# EAGLE design version1 (EAGLE 8.3.2)
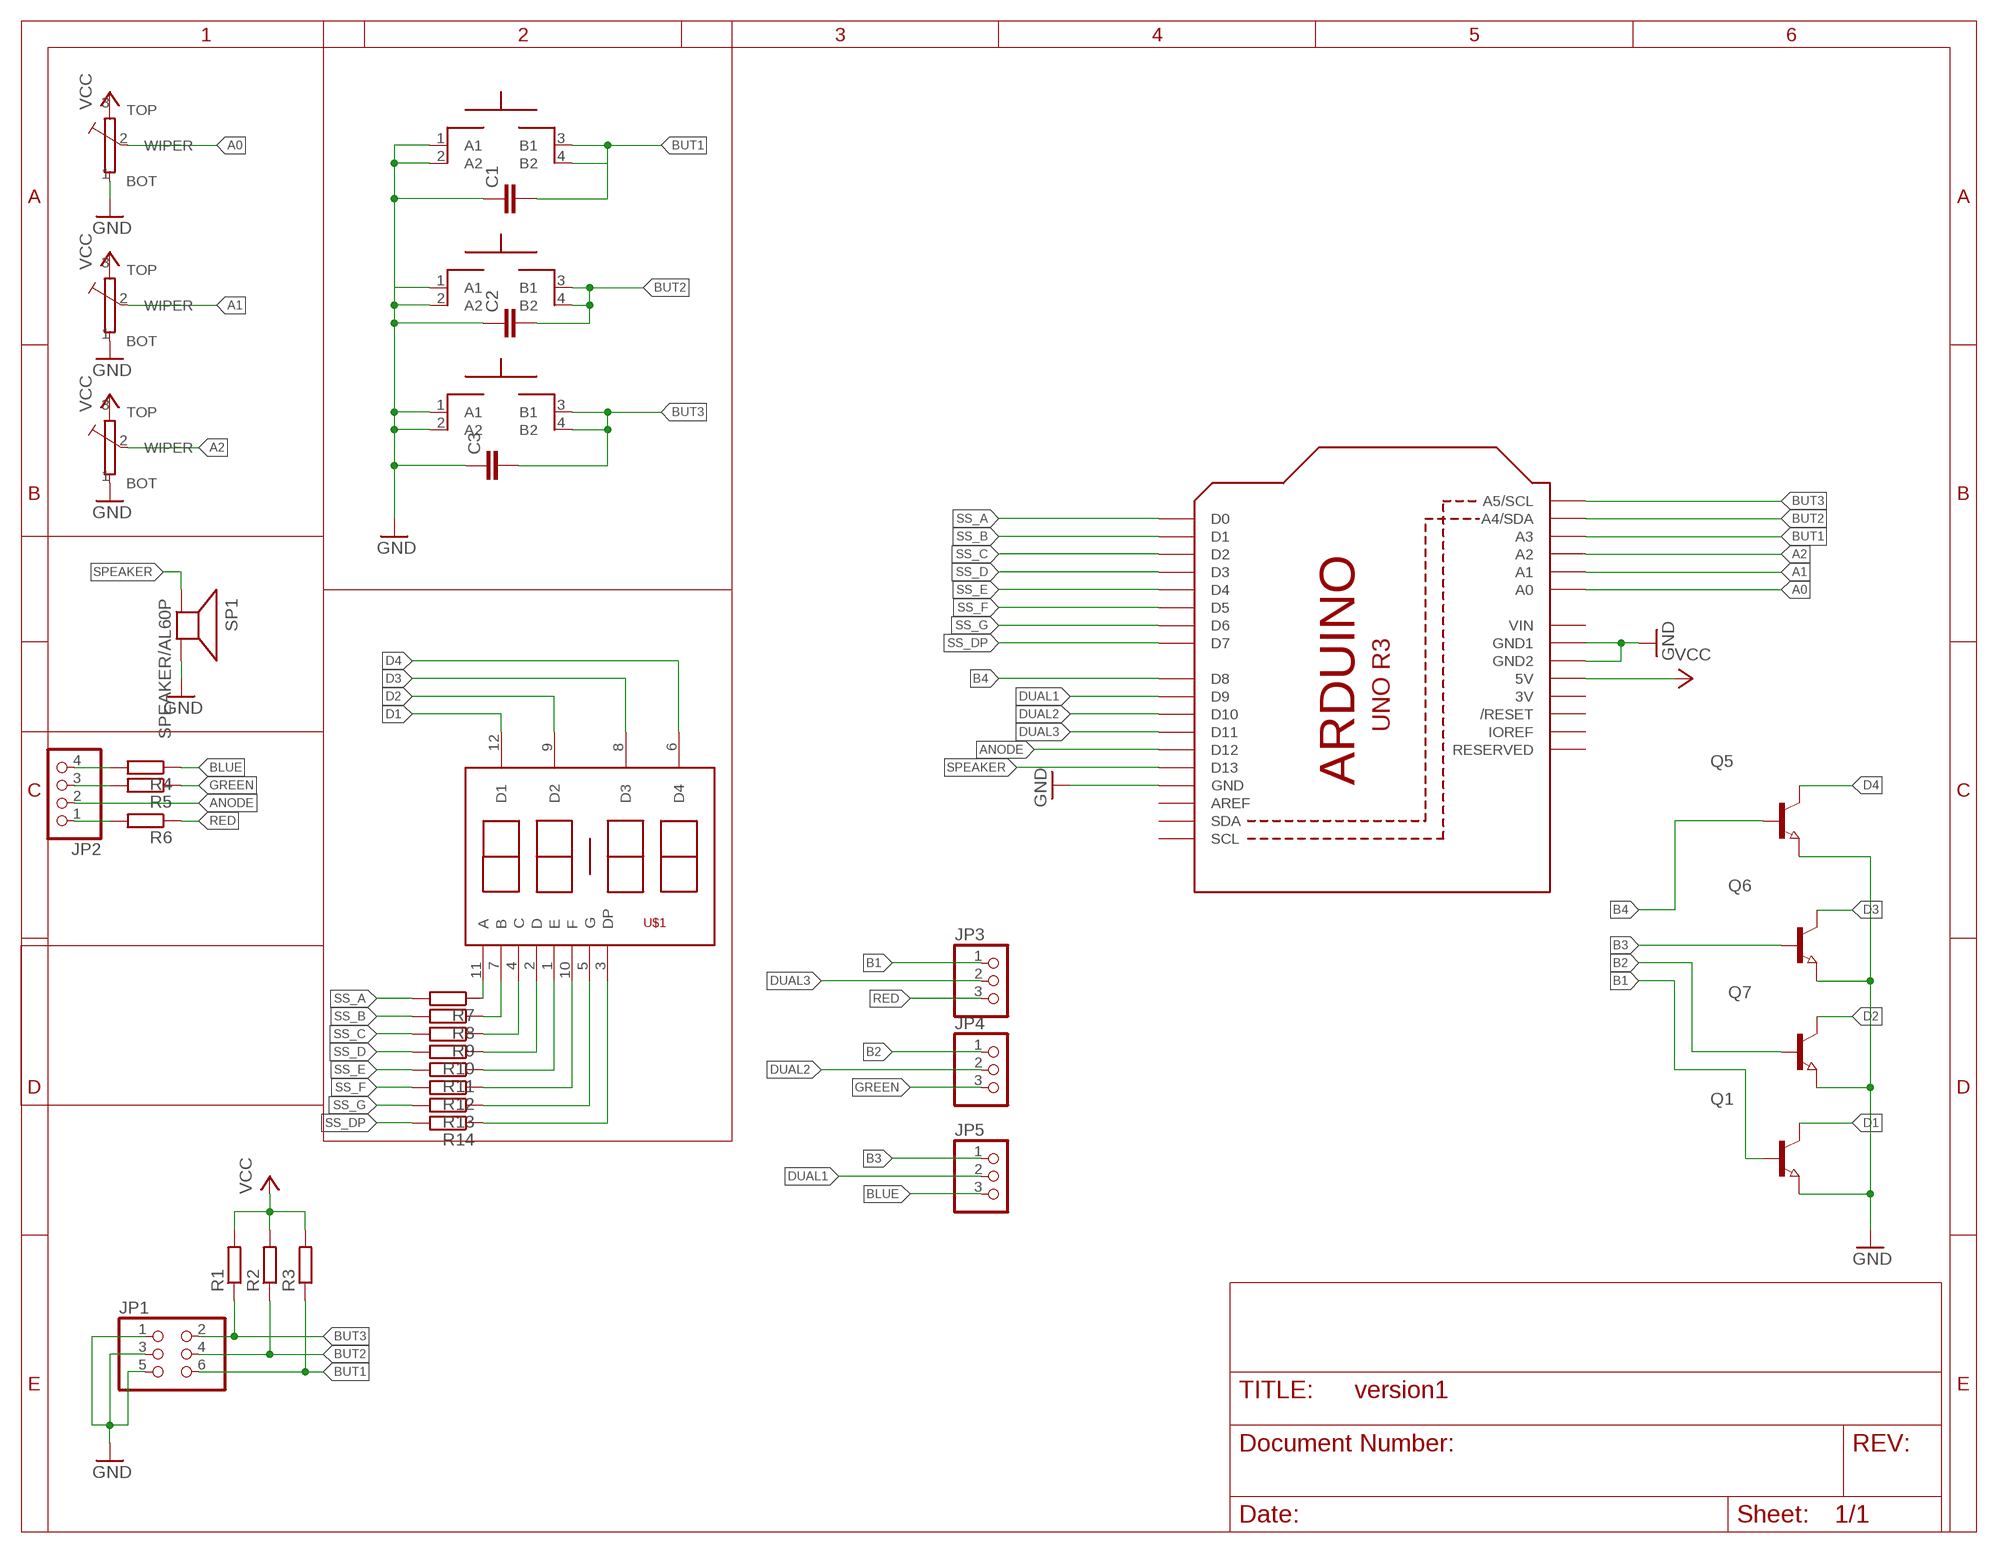
[diagram p0: schematic, sheet 1]

## Parts
C1  C-EUC0805  [C0805]
C2  C-EUC0805  [C0805]
C3  C-EUC0805  [C0805]
JP1  PINHD-2X3  [2X03]
JP2  PINHD-1X4  [1X04]
JP3  PINHD-1X3  [1X03]
JP4  PINHD-1X3  [1X03]
JP5  PINHD-1X3  [1X03]
Q1  NPN-TRANSISTOR_SOT23  [SOT23]
Q5  NPN-TRANSISTOR_SOT23  [SOT23]
Q6  NPN-TRANSISTOR_SOT23  [SOT23]
Q7  NPN-TRANSISTOR_SOT23  [SOT23]
R1  R-EU_R0805  [R0805]
R2  R-EU_R0805  [R0805]
R3  R-EU_R0805  [R0805]
R4  R-EU_R0805  [R0805]
R5  R-EU_R0805  [R0805]
R6  R-EU_R0805  [R0805]
R7  R-EU_R0805  [R0805]
R8  R-EU_R0805  [R0805]
R9  R-EU_R0805  [R0805]
R10  R-EU_R0805  [R0805]
R11  R-EU_R0805  [R0805]
R12  R-EU_R0805  [R0805]
R13  R-EU_R0805  [R0805]
R14  R-EU_R0805  [R0805]
SP1  SPEAKER/AL60P  [AL60P]
SW1  MOMENTARYBUTTON  [SPST_NO_SMD]
SW2  MOMENTARYBUTTON  [SPST_NO_SMD]
SW3  MOMENTARYBUTTON  [SPST_NO_SMD]
TR1  TRIMMTHUMB  [RV09]
TR2  TRIMMTHUMB  [RV09]
TR3  TRIMMTHUMB  [RV09]
U1  ARDUINOR3-BPLACE  [ARDUINOR3-BPLACE]
U$1  4DIG_7SEG_CATHODE  [4DIG_7SEG_CLOCK]

## Nets
A0: TR1.2(WIPER) U1.A0
A1: TR2.2(WIPER) U1.A1
A2: TR3.2(WIPER) U1.A2
ANODE: JP2.2 U1.D12
B1: JP3.1 Q1.1(B)
B2: JP4.1 Q7.1(B)
B3: JP5.1 Q6.1(B)
B4: Q5.1(B) U1.D8
BLUE: JP5.3 R4.1
BUT1: C1.2 JP1.6 R3.1 SW1.3(B1) SW1.4(B2) U1.A3
BUT2: C2.2 JP1.4 R2.1 SW2.3(B1) SW2.4(B2) U1.A4(A4/SDA)
BUT3: C3.2 JP1.2 R1.1 SW3.3(B1) SW3.4(B2) U1.A5(A5/SCL)
D1: Q1.3(C) U$1.12(D1)
D2: Q7.3(C) U$1.9(D2)
D3: Q6.3(C) U$1.8(D3)
D4: Q5.3(C) U$1.6(D4)
DUAL1: JP5.2 U1.D9
DUAL2: JP4.2 U1.D10
DUAL3: JP3.2 U1.D11
GND: C1.1 C2.1 C3.1 JP1.1 JP1.3 JP1.5 Q1.2(E) Q5.2(E) Q6.2(E) Q7.2(E) SP1.2(-) SW1.1(A1) SW1.2(A2) SW2.1(A1) SW2.2(A2) SW3.1(A1) SW3.2(A2) TR1.1(BOT) TR2.1(BOT) TR3.1(BOT) U1.GND U1.GND1 U1.GND2
GREEN: JP4.3 R5.1
N$1: JP2.4 R4.2
N$2: JP2.3 R5.2
N$3: JP2.1 R6.2
N$4: R7.1 U$1.11(A)
N$5: R8.1 U$1.7(B)
N$6: R9.1 U$1.4(C)
N$7: R10.1 U$1.2(D)
N$8: R11.1 U$1.1(E)
N$9: R12.1 U$1.10(F)
N$10: R13.1 U$1.5(G)
N$11: R14.1 U$1.3(DP)
RED: JP3.3 R6.1
SPEAKER: SP1.1(+) U1.D13
SS_A: R7.2 U1.D0
SS_B: R8.2 U1.D1
SS_C: R9.2 U1.D2
SS_D: R10.2 U1.D3
SS_DP: R14.2 U1.D7
SS_E: R11.2 U1.D4
SS_F: R12.2 U1.D5
SS_G: R13.2 U1.D6
VCC [PWR]: R1.2 R2.2 R3.2 TR1.3(TOP) TR2.3(TOP) TR3.3(TOP) U1.5V
Unconnected: U1.AREF U1.IOREF U1.RESERVED U1.RESET(/RESET) U1.SCL U1.SDA

## Power pins joined to a net without a drawn wire
3V: U1.3V
VIN: U1.VIN

## Library data of the parts
C1-C3 = rcl:C-EU: CAPACITOR, European symbol
JP1 = pinhead:PINHD-2X3: PIN HEADER
JP2 = pinhead:PINHD-1X4: PIN HEADER
JP3-JP5 = pinhead:PINHD-1X3: PIN HEADER
Q1 Q5-Q7 = semicon-smd-ipc:NPN-TRANSISTOR_: NPN TRANSISTOR
R1-R14 = rcl:R-EU_: RESISTOR, European symbol
SP1 = adafruit:SPEAKER: SPEAKER Source: Buerklin Added PS12 (for part # PS1240 piezo) http://www.ladyada.net/library/pcb/eaglelibrary.html
SW1-SW3 = brv_v6_2:MOMENTARYBUTTON
TR1-TR3 = brv_v6_2:TRIMM: TRIMMER
U1 = adafruit:ARDUINOR3: This is a new object for the new Arduino R3 - with extra pins that you may want to use (such as IOref, and duplicated A4/A5
U$1 = brv_v6_2:4DIG_7SEG_CATHODE

## Net classes
0 default: width 0.254 mm, drill 0.305 mm, clearance 0.203 mm
1 PWR: width 0.305 mm, drill 0.305 mm, clearance 0.203 mm

## Board
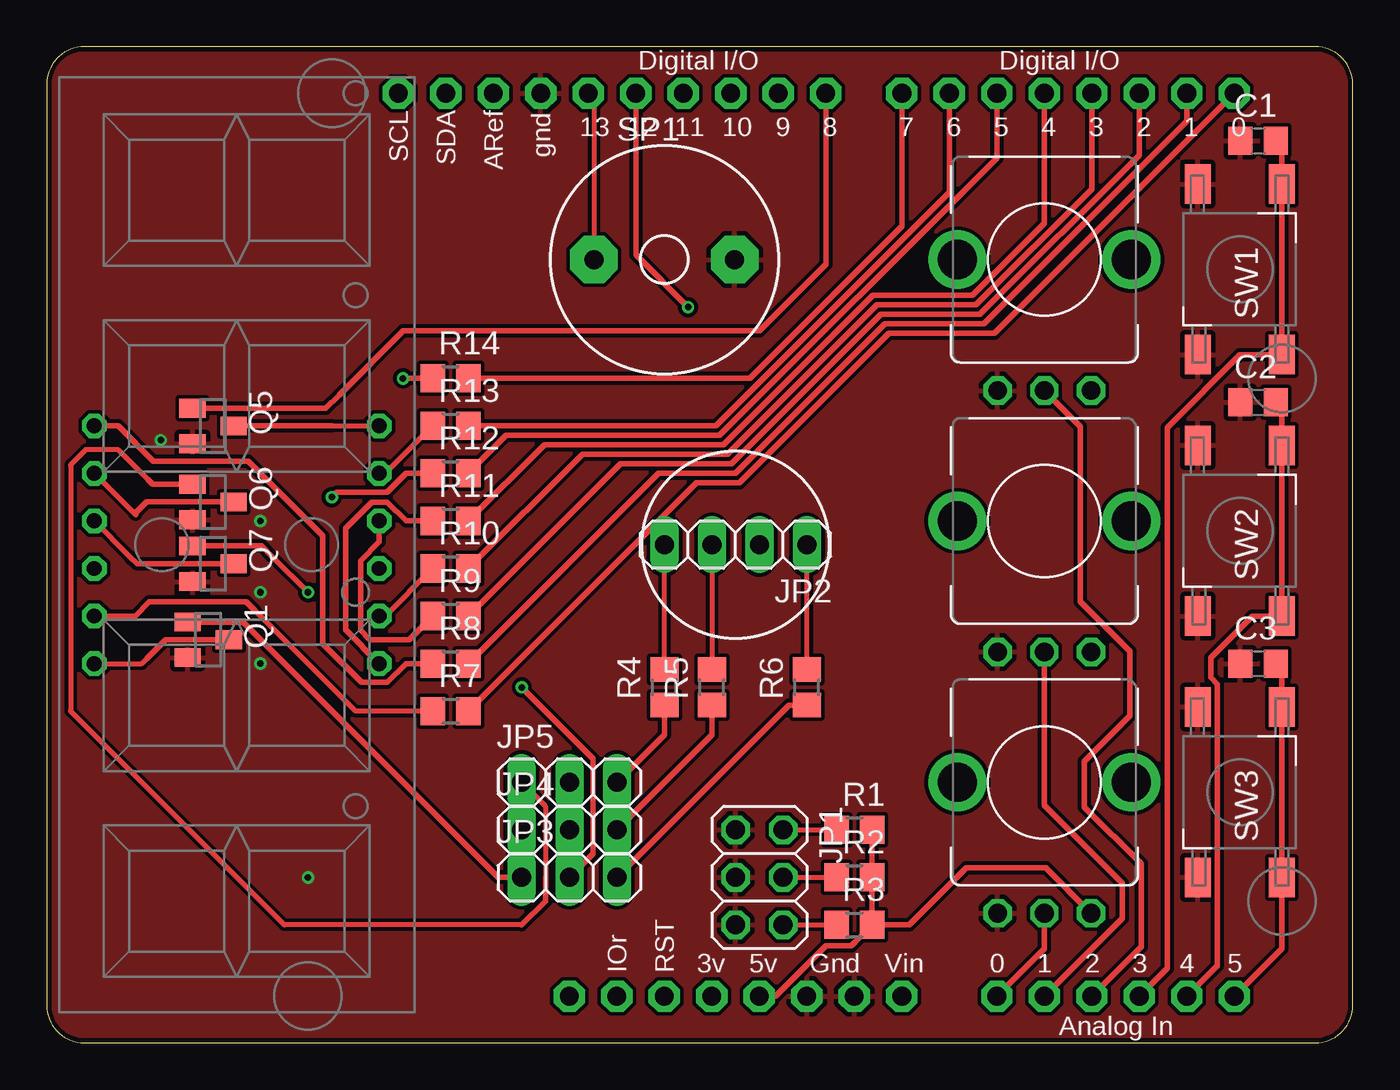
[diagram p1: board, top side]
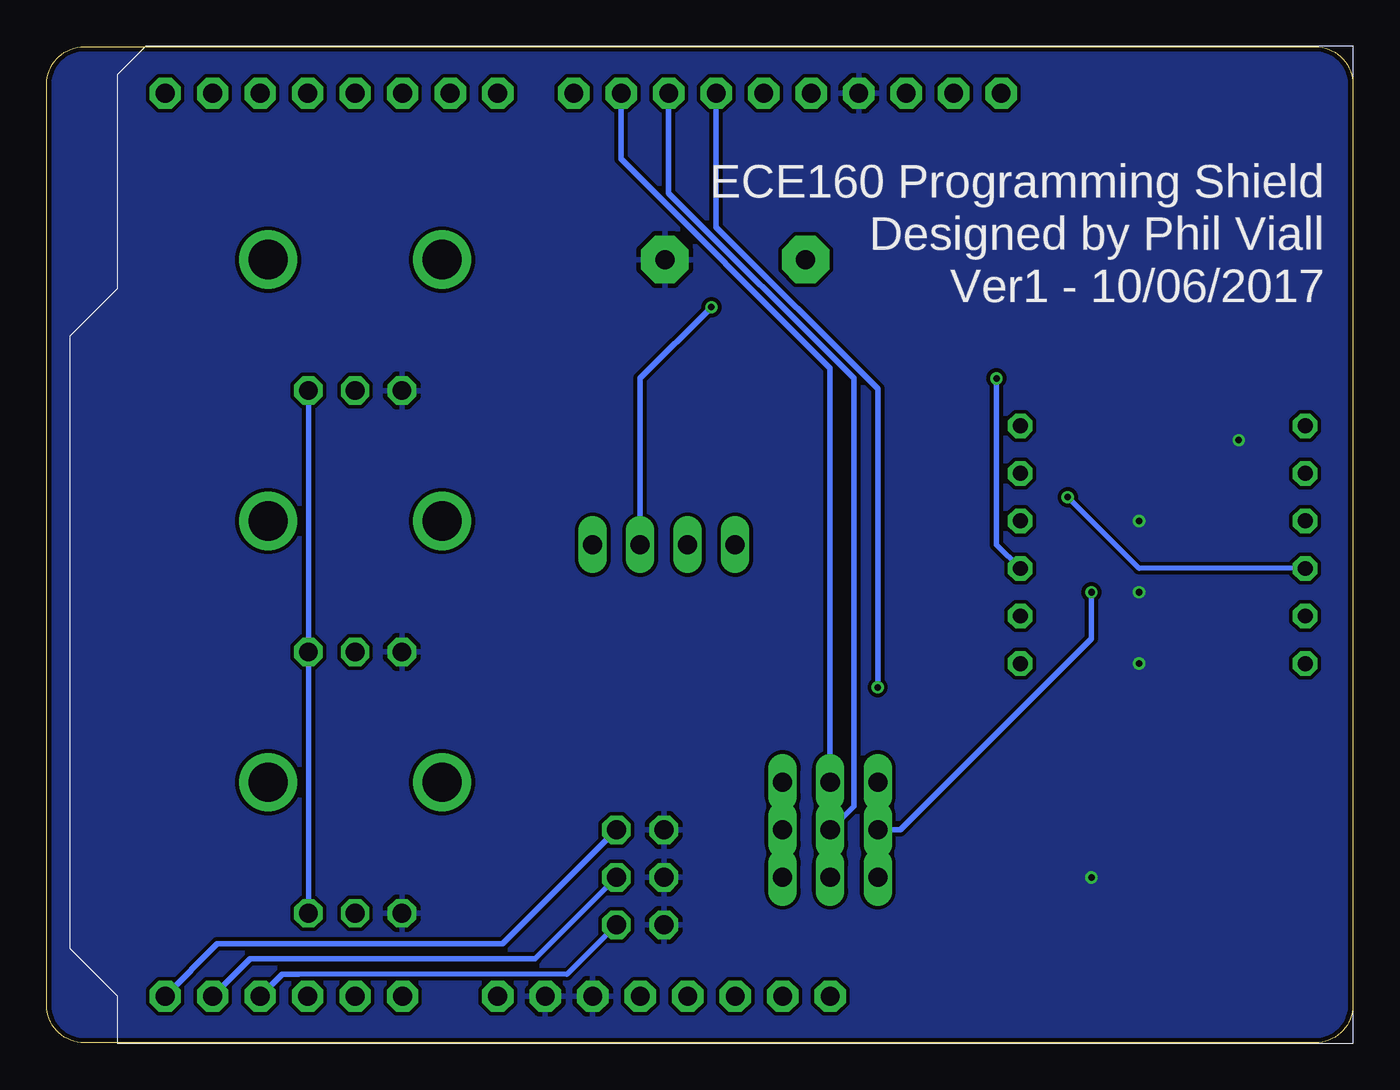
[diagram p2: board, bottom side, seen from below]

Size 69.83 x 53.24 mm. Coordinates in mm from the lower left corner, seen from the top.
Outline: 0,51.24 0,2 arc90 2,0 67.83,0 arc90 69.83,2 69.83,51.24 arc90 67.83,53.24 2,53.24 arc90 0,51.24
Copper layers (1*16): Top 0.035mm / dielectric 1.5mm / Bottom 0.035mm
Design rules "Dirty8TS *": minimum track width 5mil, minimum drill 12mil, track to track 8mil, track to pad 8mil, pad to pad 8mil, via to via 8mil, smd to smd 0mil, copper to edge 10mil, drill to drill 10mil, minimum pad ring 10mil, minimum via ring 6mil, stop-mask expansion 2mil, vias tented up to drill 25mil, thermal gap 10mil

### Footprints (pad centres in the part's own frame; a part is rotated, then mirrored left to right if it is on the bottom)
C0805 = smd 1.3 x 1.5: 1 -0.95,0; 2 0.95,0
2X03 = drill 1.016 octagon: 1 -2.54,-1.27; 2 -2.54,1.27; 3 0,-1.27; 4 0,1.27; 5 2.54,-1.27; 6 2.54,1.27
1X04 = drill 1.016 long: 1 -3.81,0; 2 -1.27,0; 3 1.27,0; 4 3.81,0
1X03 = drill 1.016 long: 1 -2.54,0; 2 0,0; 3 2.54,0
SOT23 = smd 1 x 1.4: 1 -0.95,-1.1; 2 0.95,-1.1; 3 0,1.1
R0805 = smd 1.3 x 1.5: 1 -0.95,0; 2 0.95,0
AL60P = drill 1.016 pad 2.54 octagon: 1 -3.759,0; 2 3.759,0
SPST_NO_SMD = smd 2.108 x 1.397: 1 0,4.496; 2 9.119,4.496; 3 0,0; 4 9.119,0
RV09 = drill 1 octagon: 1 -2.5,-7; 2 0,-7; 3 2.5,-7 | drill 2.1 pad 2.4: SHEILD@1 4.65,0 | drill 2.1 pad 2.5: SHIELD@2 -4.65,0
ARDUINOR3-BPLACE = drill 1 pad 1.676 octagon: 3V 35.56,2.54; 5V 38.1,2.54; A0 50.8,2.54; A1 53.34,2.54; A2 55.88,2.54; A3 58.42,2.54; A4 60.96,2.54; A5 63.5,2.54; AREF 23.876,50.8; D0 63.5,50.8; D1 60.96,50.8; D2 58.42,50.8; D3 55.88,50.8; D4 53.34,50.8; D5 50.8,50.8; D6 48.26,50.8; D7 45.72,50.8; D8 41.656,50.8; D9 39.116,50.8; D10 36.576,50.8; D11 34.036,50.8; D12 31.496,50.8; D13 28.956,50.8; GND 26.416,50.8; GND1 43.18,2.54; GND2 40.64,2.54; IOREF 30.48,2.54; RESERVED 27.94,2.54; RESET 33.02,2.54; SCL 18.796,50.8; SDA 21.336,50.8; VIN 45.72,2.54
4DIG_7SEG_CLOCK = drill 0.8 octagon: 1 -6.35,-7.62; 2 -3.81,-7.62; 3 -1.27,-7.62; 4 1.27,-7.62; 5 3.81,-7.62; 6 6.35,-7.62; 7 6.35,7.62; 8 3.81,7.62; 9 1.27,7.62; 10 -1.27,7.62; 11 -3.81,7.62; 12 -6.35,7.62

### Placement (x,y rotation side)
C1  64.77,48.21 0 top
C2  64.77,34.24 0 top
C3  64.77,20.27 0 top
JP1  38.1,8.84 270 top
JP2  36.83,26.62 180 top
JP3  27.94,8.84 0 top
JP4  27.94,11.38 0 top
JP5  27.94,13.92 0 top
Q1  8.64,21.54 270 top
Q5  8.89,32.97 270 top
Q6  8.89,28.91 270 top
Q7  8.89,25.6 270 top
R1  43.18,11.38 0 top
R2  43.18,8.84 0 top
R3  43.18,6.3 0 top
R4  33.02,19 90 top
R5  35.56,19 90 top
R6  40.64,19 90 top
R7  21.59,17.73 0 top
R8  21.59,20.27 0 top
R9  21.59,22.81 0 top
R10  21.59,25.35 0 top
R11  21.59,27.89 0 top
R12  21.59,30.43 0 top
R13  21.59,32.97 0 top
R14  21.59,35.51 0 top
SP1  33.02,41.86 0 top
SW1  66.04,36.78 90 top
SW2  66.04,22.81 90 top
SW3  66.04,8.84 90 top
TR1  53.34,13.92 0 top
TR2  53.34,27.89 0 top
TR3  53.34,41.86 0 top
U1  0,-0.05 0 top
U$1  10.16,26.62 90 top

### Tracks (layer width: path | path; a pad name or v marks a point on that pad's centre or on a via)
A0
  Top 0.305: TR1.2 53.34,5.03 U1.A0
A1
  Top 0.305: U1.A1 57.51,6.66 57.51,8.53 53.34,12.7 TR2.2
A2
  Top 0.305: TR3.2 55.28,32.92 55.28,23.57 57.91,20.93 57.91,17.48 55.48,15.05 55.48,12.6 58.52,9.56 58.52,5.13 U1.A2
ANODE  (via drill 0.35)
  Top 0.305: v34.29,39.32 31.5,42.11 U1.D12
  Bottom 0.305: JP2.2 38.1,35.51 v34.29,39.32
B1
  Top 0.305: Q1.1 10.49,22.49 10.79,22.19 10.79,22.18 24.13,8.84 JP3.1
B2  (via drill 0.35)
  Top 0.254: 11.75,26.3 12.06,25.98 v13.97,24.08
  Top 0.305: Q7.1 11.5,26.55 12.06,25.98
  Bottom 0.305: JP4.1 24.18,11.38 13.97,21.59 v13.97,24.08
B3
  Top 0.254: JP5.1 26.67,12.65 26.67,8.84 | 25.4,6.3 12.7,6.3 1.27,17.73 1.27,30.89 2.08,31.7 3.81,31.7 5.4,30.11
  Top 0.305: 26.67,8.84 26.67,7.57 25.4,6.3 | 5.4,30.11 5.65,29.86 Q6.1
B4
  Top 0.305: 15.62,34.62 14.92,33.92 | 15.62,34.62 19.05,38.05 38.1,38.05 41.66,41.61 U1.D8 | Q5.1 14.92,33.92 | 14.92,33.92 15.62,34.62
BLUE
  Top 0.305: JP5.3 33.02,16.46 R4.1
BUT1
  Top 0.254: JP1.6 R3.1
  Top 0.305: SW1.4 66.04,45.35 | SW1.4 SW1.3 63.8,36.78 59.9,32.88 59.9,3.97 U1.A3 | C1.2 66.04,47.89 SW1.4
  Bottom 0.254: JP1.6 42.01,3.66 56.36,3.66
  Bottom 0.305: 56.36,3.66 57.25,3.66 U1.A3
BUT2
  Top 0.254: JP1.4 R2.1
  Top 0.305: SW2.4 66.04,31.38 | SW2.4 SW2.3 64.46,22.81 62.23,20.58 62.23,19.53 62.6,19.16 62.6,4.13 U1.A4 | C2.2 66.04,33.92 SW2.4
  Bottom 0.254: 43.71,4.5 JP1.4
  Bottom 0.305: U1.A4 58.95,4.5 43.71,4.5
BUT3
  Top 0.254: JP1.2 R1.1
  Top 0.305: SW3.4 66.04,17.41 | SW3.4 SW3.3 66.04,5.03 U1.A5 | C3.2 66.04,19.95 SW3.4
  Bottom 0.305: JP1.2 45.47,5.28 60.71,5.28 U1.A5
D1
  Top 0.254: U$1.12 5.08,20.27 5.33,20.52 5.4,20.59
  Top 0.305: Q1.3 6.35,21.54 5.33,20.52
D2
  Top 0.254: 4.45,25.98 U$1.9
  Top 0.305: Q7.3 4.83,25.6 4.45,25.98
D3
  Top 0.254: U$1.8 4.7,28.27 4.76,28.21
  Top 0.305: 4.7,28.27 5.33,28.91 Q6.3
D4
  Top 0.254: 15.24,32.97 U$1.6
  Top 0.305: Q5.3 15.24,32.97
DUAL1
  Bottom 0.305: JP5.2 27.94,36.06 39.12,47.24 U1.D9
DUAL2
  Bottom 0.305: JP4.2 26.67,12.65 26.67,35.51 36.58,45.42 U1.D10
DUAL3  (via drill 0.35)
  Top 0.305: JP3.2 29.21,10.11 29.21,15.19 v25.4,19
  Bottom 0.305: U1.D11 34.04,43.59 25.4,34.96 v25.4,19
GND  (via drill 0.35)
  other vias: 13.97,8.84 11.43,24.08 11.43,27.89 11.43,20.27 6.1,32.21
  pour Top: 0.2,-0.41 -0.2,54.46 69.65,54.46 70.05,-0.41
  pour Bottom: 0,-0.41 0,53.29 69.85,53.29 69.85,-0.41
GREEN
  Top 0.305: JP4.3 35.56,16.46 R5.1
N$1
  Top 0.254: R4.2 JP2.4
N$2
  Top 0.254: JP2.3 R5.2
N$3
  Top 0.254: R6.2 JP2.1
N$4
  Top 0.254: R7.1 16.51,17.73 11.12,23.12
  Top 0.305: 11.12,23.12 10.67,23.57 5.49,23.57 4.72,22.81 U$1.11
N$5
  Top 0.305: R8.1 19.21,20.27 18.2,19.26 16.84,19.26 14.76,21.34 14.76,27.1 10.77,31.09 5.69,31.09 3.81,32.97 U$1.7
N$6
  Top 0.305: U$1.4 17.78,26.78 16.77,25.77 16.77,22.04 17.27,21.54 19.37,21.54 R9.1
N$7
  Top 0.254: U$1.2 18.1,22.81 R10.1
N$8
  Top 0.305: R11.1 19.21,27.89 18.2,28.9 17.36,28.9 15.97,27.51 15.97,22.08 U$1.1
N$9  (via drill 0.35)
  Top 0.305: R12.1 19.21,30.43 18.2,29.42 15.5,29.42 v15.24,29.16
  Bottom 0.254: U$1.10 11.43,25.35 v15.24,29.16
N$10
  Top 0.254: U$1.5 18.1,30.43 R13.1
N$11  (via drill 0.35)
  Top 0.305: v19.05,35.51 R14.1
  Bottom 0.305: U$1.3 19.05,26.62 v19.05,35.51
RED
  Top 0.305: JP3.3 39.69,18.05 R6.1
SPEAKER
  Top 0.254: U1.D13 29.26,50.44 SP1.1
SS_A
  Top 0.305: R7.2 34.73,29.92 37.03,29.92 45.02,37.91 50.66,37.91 U1.D0
SS_B
  Top 0.305: R8.2 32.7,30.43 36.82,30.43 44.81,38.42 50.11,38.42 60.96,49.27 U1.D1
SS_C
  Top 0.305: R9.2 30.67,30.94 36.61,30.94 44.6,38.93 49.9,38.93 58.42,47.45 U1.D2
SS_D
  Top 0.305: R10.2 28.64,31.45 36.4,31.45 44.39,39.44 49.69,39.44 55.88,45.62 U1.D3
SS_DP
  Top 0.305: R14.2 37.59,35.51 45.72,43.64 U1.D7
SS_E
  Top 0.305: R11.2 26.6,31.95 36.19,31.95 44.18,39.95 49.48,39.95 53.34,43.8 U1.D4
SS_F
  Top 0.305: U1.D5 50.8,47.28 35.98,32.46 24.57,32.46 R12.2
SS_G
  Top 0.305: R13.2 35.77,32.97 48.26,45.46 U1.D6
VCC
  Top 0.305: R3.2 43.24,5.41 43.24,5.4 43.03,5.19 41.66,5.19 38.95,2.49 U1.5V | R1.2 R2.2 R3.2 | 54.73,8.03 TR1.3 53.41,9.35 49.17,9.35 46.13,6.3 R3.2
  Bottom 0.305: TR1.3 TR3.3 TR2.3

### Text on the board
bPlace: ECE160 Programming Shield | Designed by Phil Viall | Ver1 - 10/06/2017